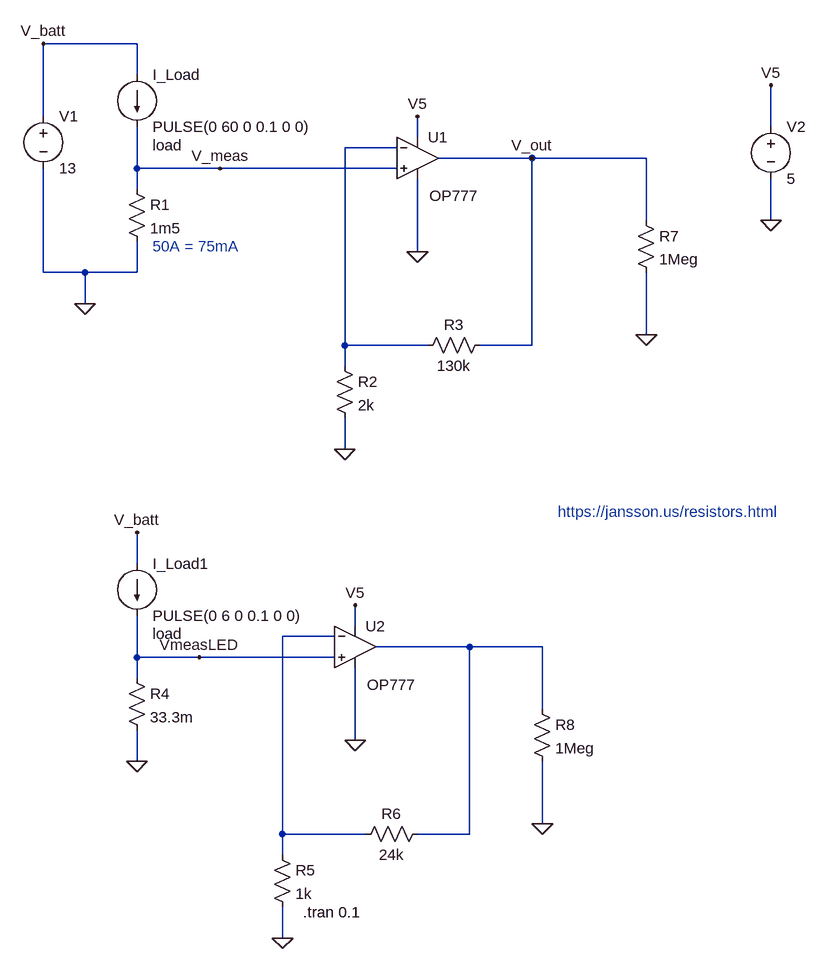
[diagram p0: schematic CurrentMeasSim777.asc]
CurrentMeasSim777.asc, the LTspice schematic file:
Version 4
SHEET 1 880 1380
WIRE -160 -16 -304 -16
WIRE -160 32 -160 -16
WIRE -304 96 -304 -16
WIRE 816 112 816 48
WIRE 272 128 272 96
WIRE 240 144 160 144
WIRE 448 160 304 160
WIRE 624 160 448 160
WIRE -160 176 -160 112
WIRE -32 176 -160 176
WIRE 240 176 -32 176
WIRE -160 208 -160 176
WIRE 624 256 624 160
WIRE 816 256 816 192
WIRE 272 304 272 192
WIRE -304 336 -304 176
WIRE -240 336 -304 336
WIRE -160 336 -160 288
WIRE -160 336 -240 336
WIRE -240 384 -240 336
WIRE 624 432 624 336
WIRE 160 448 160 144
WIRE 288 448 160 448
WIRE 448 448 448 160
WIRE 448 448 368 448
WIRE 160 480 160 448
WIRE 160 608 160 560
WIRE -160 784 -160 736
WIRE 176 880 176 848
WIRE 144 896 64 896
WIRE 352 912 208 912
WIRE 464 912 352 912
WIRE -160 928 -160 864
WIRE -64 928 -160 928
WIRE 144 928 -64 928
WIRE -160 960 -160 928
WIRE 464 1008 464 912
WIRE 176 1056 176 944
WIRE -160 1088 -160 1040
WIRE 464 1184 464 1088
WIRE 64 1200 64 896
WIRE 192 1200 64 1200
WIRE 352 1200 352 912
WIRE 352 1200 272 1200
WIRE 64 1232 64 1200
WIRE 64 1360 64 1312
FLAG -240 384 0
FLAG 816 256 0
FLAG 816 48 V5
FLAG 272 304 0
FLAG 160 608 0
FLAG -32 176 V_meas
FLAG -304 -16 V_batt
FLAG 272 96 V5
FLAG 176 1056 0
FLAG 64 1360 0
FLAG 176 848 V5
FLAG -160 1088 0
FLAG -160 736 V_batt
FLAG 448 160 V_out
FLAG 624 432 0
FLAG -64 928 VmeasLED
FLAG 464 1184 0
SYMBOL voltage -304 80 R0
SYMATTR InstName V1
SYMATTR Value 13
SYMBOL voltage 816 96 R0
WINDOW 123 0 0 Left 0
WINDOW 39 0 0 Left 0
SYMATTR InstName V2
SYMATTR Value 5
SYMBOL current -160 32 R0
WINDOW 123 0 0 Left 0
WINDOW 39 24 108 Left 2
SYMATTR SpiceLine load
SYMATTR InstName I_Load
SYMATTR Value PULSE(0 60 0 0.1 0 0)
SYMBOL res -176 192 R0
SYMATTR InstName R1
SYMATTR Value 1m5
SYMBOL res 144 464 R0
SYMATTR InstName R2
SYMATTR Value 2k
SYMBOL res 384 432 R90
WINDOW 0 0 56 VBottom 2
WINDOW 3 32 56 VTop 2
SYMATTR InstName R3
SYMATTR Value 130k
SYMBOL Opamps\\OP777 272 96 R0
WINDOW 3 18 122 Left 2
SYMATTR InstName U1
SYMBOL current -160 784 R0
WINDOW 123 0 0 Left 0
WINDOW 39 24 108 Left 2
SYMATTR SpiceLine load
SYMATTR InstName I_Load1
SYMATTR Value PULSE(0 6 0 0.1 0 0)
SYMBOL res -176 944 R0
SYMATTR InstName R4
SYMATTR Value 33.3m
SYMBOL res 48 1216 R0
SYMATTR InstName R5
SYMATTR Value 1k
SYMBOL res 288 1184 R90
WINDOW 0 0 56 VBottom 2
WINDOW 3 32 56 VTop 2
SYMATTR InstName R6
SYMATTR Value 24k
SYMBOL Opamps\\OP777 176 848 R0
WINDOW 3 18 122 Left 2
SYMATTR InstName U2
SYMBOL res 608 240 R0
SYMATTR InstName R7
SYMATTR Value 1Meg
SYMBOL res 448 992 R0
SYMATTR InstName R8
SYMATTR Value 1Meg
TEXT 96 1320 Left 2 !.tran 0.1
TEXT -136 296 Left 2 ;50A = 75mA
TEXT 488 704 Left 2 ;https://jansson.us/resistors.html

The netlist it stands for:
* CurrentMeasSim777.asc
V1 V_batt 0 13
V2 V5 0 5
I_Load V_batt V_meas PULSE(0 60 0 0.1 0 0) load
R1 V_meas 0 1m5
R2 N001 0 2k
R3 V_out N001 130k
XU1 V_meas N001 V5 0 V_out OP777  ; pins In+ In- V+ V- OUT
I_Load1 V_batt VmeasLED PULSE(0 6 0 0.1 0 0) load
R4 VmeasLED 0 33.3m
R5 N002 0 1k
R6 N003 N002 24k
XU2 VmeasLED N002 V5 0 N003 OP777  ; pins In+ In- V+ V- OUT
R7 V_out 0 1Meg
R8 N003 0 1Meg
.tran 0.1
* 50A = 75mA
* https://jansson.us/resistors.html
.lib ADI.lib
.backanno
.end